# EAGLE design out_board (EAGLE 9.3.0)
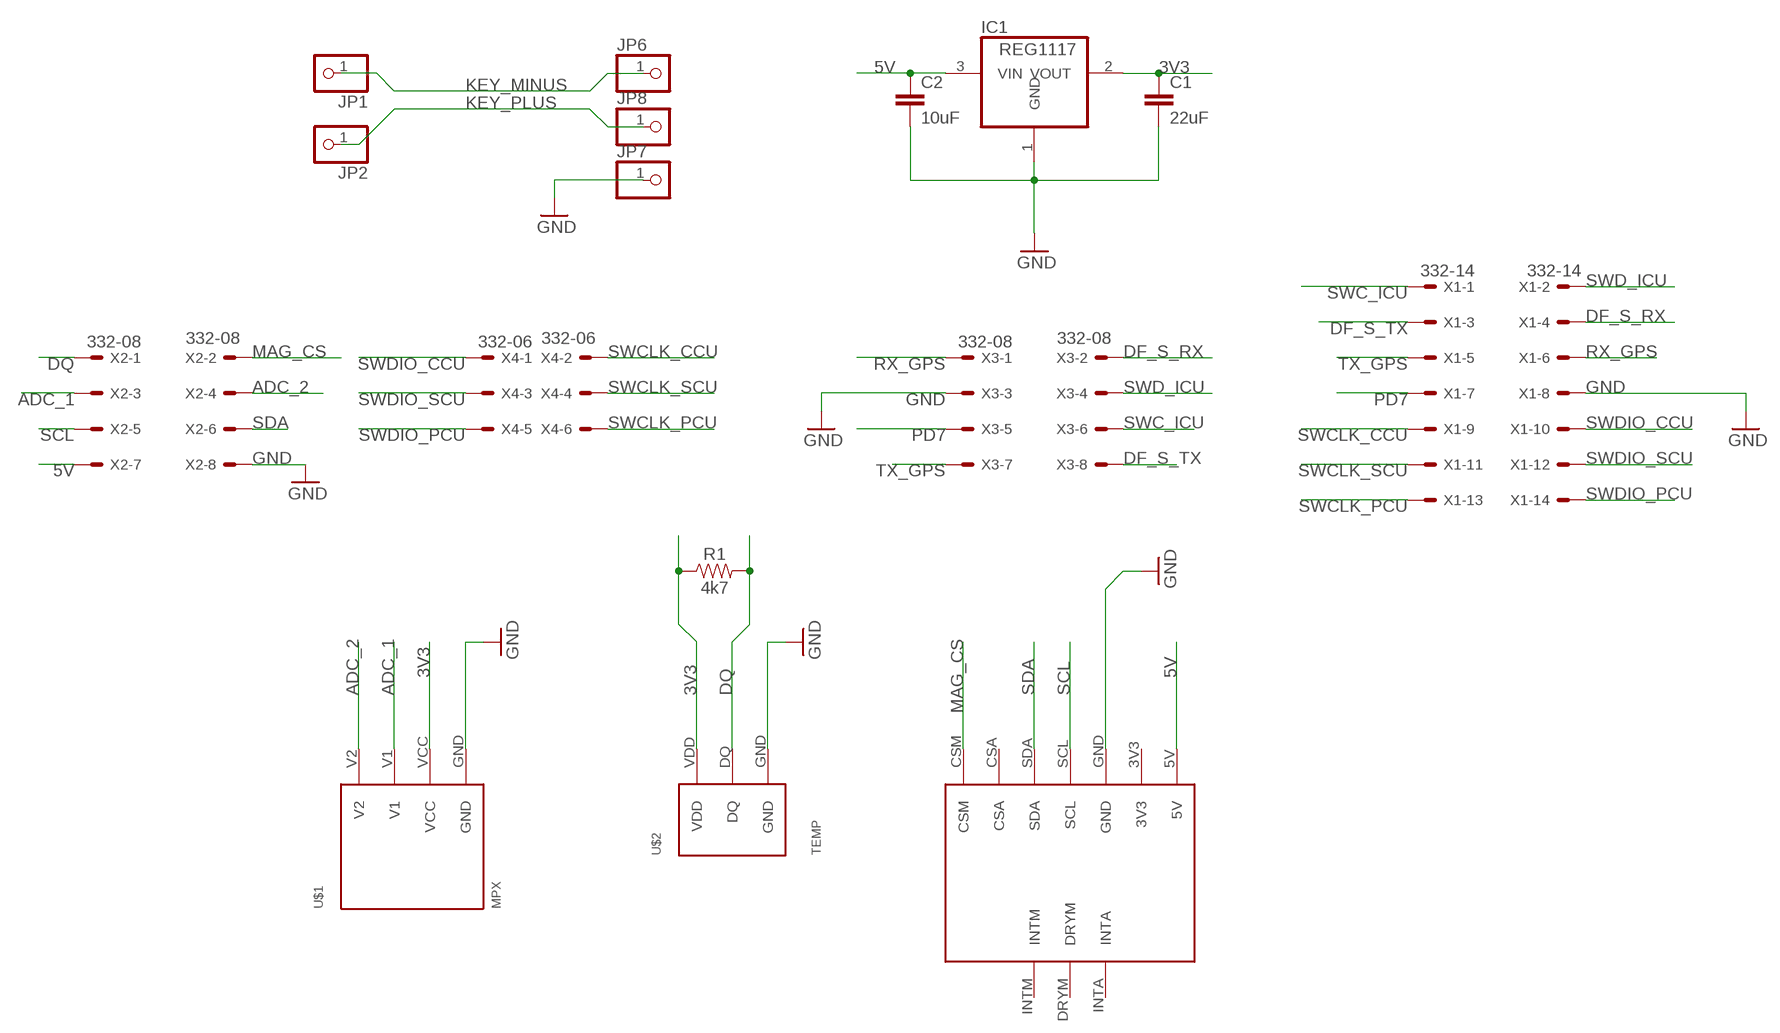
[diagram p0: schematic, sheet 1]

## Parts
C1  22uF  22UF-0805-6.3V-20%  [0805]
C2  10uF  22UF-0805-16V-20%  [0805]
IC1  REG1117  [SOT223]
JP1  PINHD-1X1  [1X01]
JP2  PINHD-1X1  [1X01]
JP6  PINHD-1X1  [1X01]
JP7  PINHD-1X1  [1X01]
JP8  PINHD-1X1  [1X01]
R1  4k7  RESISTORAXIAL-0.3  [AXIAL-0.3]
U$1  MPX  [MPX]
U$2  TEMP  [TEMP]
U$3  LSM303C  [LSM303C]
X1  332-14  [332-14]
X2  332-08  [332-08]
X3  332-08  [332-08]
X4  332-06  [332-06]

## Nets
3V3: C1.1 IC1.2(VOUT) R1.P$1 U$1.VCC U$2.VDD
5V: C2.1 IC1.3(VIN) U$3.5V X2.7
ADC_1: U$1.V1 X2.3
ADC_2: U$1.V2 X2.4
DF_S_RX: X1.4 X3.2
DF_S_TX: X1.3 X3.8
DQ: R1.P$2 U$2.DQ X2.1
GND: C1.2 C2.2 IC1.1(GND) JP7.1 U$1.GND U$2.GND U$3.GND X1.8 X2.8 X3.3
KEY_MINUS: JP1.1 JP6.1
KEY_PLUS: JP2.1 JP8.1
MAG_CS: U$3.CSM X2.2
PD7: X1.7 X3.5
RX_GPS: X1.6 X3.1
SCL: U$3.SCL X2.5
SDA: U$3.SDA X2.6
SWC_ICU: X1.1 X3.6
SWCLK_CCU: X1.9 X4.2
SWCLK_PCU: X1.13 X4.6
SWCLK_SCU: X1.11 X4.4
SWD_ICU: X1.2 X3.4
SWDIO_CCU: X1.10 X4.1
SWDIO_PCU: X1.14 X4.5
SWDIO_SCU: X1.12 X4.3
TX_GPS: X1.5 X3.7
Unconnected: U$3.3V3 U$3.CSA U$3.DRYM U$3.INTA U$3.INTM

## Library data of the parts
C1 = SparkFun-Capacitors:22UF: 22µF ceramic capacitors A capacitor is a passive two-terminal electrical component used to store electrical energy temporarily in an electric field.; PROD_ID: CAP-08402
C2 = SparkFun-Capacitors:22UF: 22µF ceramic capacitors A capacitor is a passive two-terminal electrical component used to store electrical energy temporarily in an electric field.; PROD_ID: CAP-14260; VALUE: 22uF
IC1 = burr-brown:REG1117: 800mA and 1A Low Dropout (LDO) Positive Regulator 1.8V, 2.5V, 2.85V, 3.3V, 5V, and Adj; MPN: REG1117; OC_FARNELL: 1097566; OC_NEWARK: 14P6981
JP1 JP2 JP6-JP8 = pinhead:PINHD-1X1: PIN HEADER
R1 = SparkFun-Resistors:RESISTOR: Generic Resistor Package
U$1 = bluepill:MPX
U$2 = bluepill:TEMP
U$3 = bluepill:LSM303C
X1 = con-garry:332-14: 14 Pin - 2mm Dual Row Source: www.mpe-connector.de / garry_shortform_2012.pdf
X2 X3 = con-garry:332-08: 8 Pin - 2mm Dual Row Source: www.mpe-connector.de / garry_shortform_2012.pdf
X4 = con-garry:332-06: 6 Pin - 2mm Dual Row Source: www.mpe-connector.de / garry_shortform_2012.pdf

## Board
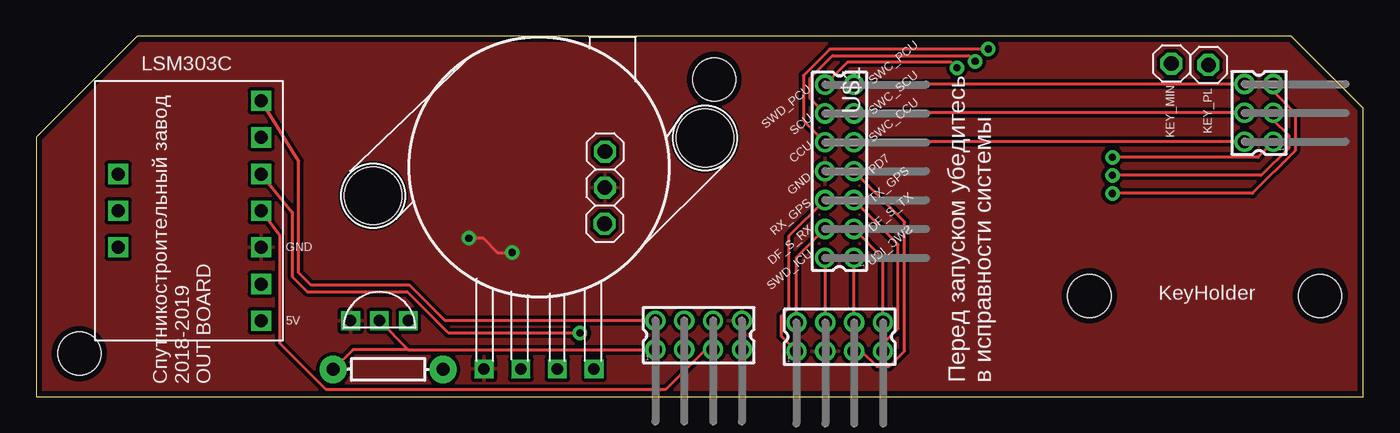
[diagram p1: board, top side]
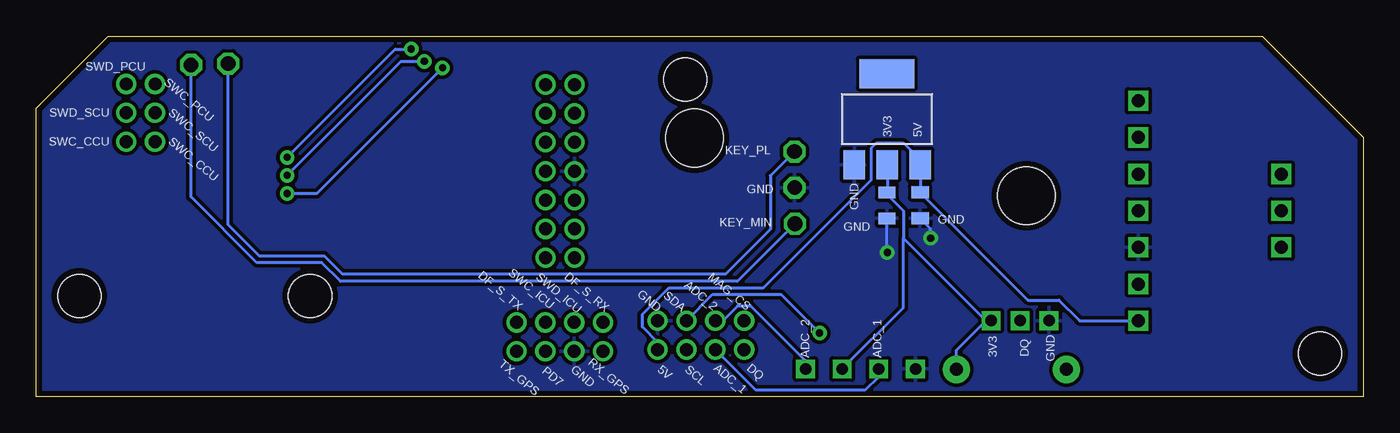
[diagram p2: board, bottom side, seen from below]

Size 92 x 25 mm. Coordinates in mm from the lower left corner, seen from the top.
Outline: 0,0 92,0 92,20 87,25 7,25 0,18 0,0
Copper layers (1*16): Top 0.035mm / dielectric 1mm / Bottom 0.035mm
Design rules "rezonit": minimum track width 0.2mm, minimum drill 0.5mm, track to track 0.25mm, track to pad 0.25mm, pad to pad 0.25mm, via to via 0.25mm, smd to smd 0.2mm, copper to edge 0.4mm, drill to drill 0.4mm, minimum pad ring 0.25mm, minimum via ring 0.25mm, stop-mask expansion 4mil, vias tented up to drill 0.6mm, thermal gap 10mil
Holes 3 mm at 3,3 47,22 89,7 73,7

### Footprints (pad centres in the part's own frame; a part is rotated, then mirrored left to right if it is on the bottom)
0805 = smd 0.8 x 1.2: 1 -0.9,0; 2 0.9,0
SOT223 = smd 1.499 x 2.007: 1 -2.261,-3.15; 2 0.025,-3.15; 3 2.311,-3.15 | smd 3.81 x 2.007: 4 0,3.15
1X01 = drill 1.016 octagon: 1 0,0
AXIAL-0.3 = drill 0.9 pad 1.88: P$1 -3.81,0; P$2 3.81,0
MPX = drill 0.8 square: GND 14,-3.81; V1 14,-1.27; V2 14,3.81; VCC 14,1.27 | hole 4: -2,11.5; 2,-11.5
TEMP = drill 0.8 square: DQ -0.5,0; GND -0.5,-2; VDD -0.5,2
LSM303C = drill 0.9 square: 3V3 -5,5.08; 5V -5,7.62; CSA -5,-5.08; CSM -5,-7.62; DRYM 4.9,0; GND -5,2.54; INTA 4.9,2.54; INTM 4.9,-2.54; SCL -5,0; SDA -5,-2.54
332-14 = drill 0.9 pad 1.27: 1 -6,-1; 2 -6,1; 3 -4,-1; 4 -4,1; 5 -2,-1; 6 -2,1; 7 0,-1; 8 0,1; 9 2,-1; 10 2,1; 11 4,-1; 12 4,1; 13 6,-1; 14 6,1
332-08 = drill 0.9 pad 1.27: 1 -3,-1; 2 -3,1; 3 -1,-1; 4 -1,1; 5 1,-1; 6 1,1; 7 3,-1; 8 3,1
332-06 = drill 0.9 pad 1.27: 1 -2,-1; 2 -2,1; 3 0,-1; 4 0,1; 5 2,-1; 6 2,1

### Placement (x,y rotation side)
C1  33.03,13.27 270 bottom
C2  30.73,13.28 270 bottom
IC1  33.03,19.25 0 bottom
JP1  81.26,23 0 top
JP2  78.68,23.1 0 top
JP6  39.4,12 0 top
JP7  39.42,14.5 0 top
JP8  39.44,17 0 top
R1  24.4,1.9 180 top
U$1  34.86,15.94 270 top
U$2  23.8,4.78 270 top
U$3  10.6,12.9 180 top
X1  55.68,15.64 90 top
X2  45.92,4.28 0 top
X3  55.7,4.16 0 top
X4  84.76,19.68 90 top

### Tracks (layer width: path | path; a pad name or v marks a point on that pad's centre or on a via)
3V3
  Bottom 0.2: IC1.2 33.01,14.2 C1.1 33.03,14.03 31.9,12.9 31.9,11 | 31.9,11 26.18,5.28 | 26.18,5.28 U$2.VDD | U$1.VCC 31.9,6.17 31.9,11 | R1.P$1 28.21,3.25 26.18,5.28
5V
  Bottom 0.2: X2.7 48.92,3.79 49.97,4.84 49.97,5.71 48.13,7.55 41.59,7.55 34.1,15.04 34.1,17.25 33.75,17.6 31.9,17.6 30.72,16.42 IC1.3 30.72,14.19 C2.1 23.25,6.7 21.1,6.7 19.7,5.3 19.7,5.28 U$3.5V
ADC_1
  Bottom 0.2: U$1.V1 33.59,1.41 34.5,0.5 42.14,0.5 X2.3
ADC_2
  Bottom 0.2: X2.4 44.41,5.28 43.35,6.33 42.48,6.33 38.67,2.52 U$1.V2
DF_S_RX
  Top 0.2: X3.2 52.7,9.66 X1.4
DF_S_TX
  Top 0.2: X3.8 58.7,9.62 X1.3
DQ
  Top 0.2: U$2.DQ 25.8,3.28 | 25.8,3.28 X2.1 | 25.8,3.28 21.97,3.28 R1.P$2
GND  (via drill 0.5)
  Top 0.2: v30,11 31,11 32,10 v33,10
  Bottom 0.2: v30,11 30,11.65 C2.2 | v33,10 33.03,10.03 C1.2
  pour Top: 0,0 0,18 7,25 87,25 92,20 92,0
  pour Bottom: 0,0 0,18 7,25 87,25 92,20 92,0
KEY_MINUS
  Bottom 0.2: JP6.1 43.4,8 70.9,8 72.2,9.3 76.7,9.3 81.26,13.86 JP1.1
KEY_PLUS
  Bottom 0.2: JP8.1 41.1,15.34 41.1,11.6 44.2,8.5 70.76,8.5 72.01,9.75 76.51,9.75 78.68,11.92 JP2.1
MAG_CS
  Top 0.2: X2.2 28.36,5.28 25.89,7.75 19.06,7.75 18.21,8.6 18.21,16.34 U$3.CSM
PD7
  Top 0.2: X3.5 57.22,3.16 58.27,2.11 59.13,2.11 60.2,3.17 60.2,12.12 X1.7
RX_GPS
  Top 0.2: X3.1 51.65,4.21 51.65,5.59 52.2,6.14 52.2,11.16 X1.6
SCL
  Top 0.2: X2.5 46.41,3.28 43.62,0.5 20.1,0.5 16.9,3.7 16.9,11.12 U$3.SCL
SDA  (via drill 0.5)
  Top 0.2: v37.7,4.43 28.57,4.43 25.7,7.3 18.8,7.3 17.76,8.34 17.76,12.8 U$3.SDA
  Bottom 0.2: X2.6 45.1,7.1 40.37,7.1 v37.7,4.43
SWC_ICU
  Top 0.2: X3.6 56.7,9.62 X1.1
SWCLK_CCU
  Top 0.2: X4.2 56.72,17.68 X1.9
SWCLK_PCU
  Top 0.2: X4.6 56.72,21.68 X1.13
SWCLK_SCU
  Top 0.2: X4.4 56.72,19.68 X1.11
SWD_ICU
  Top 0.2: X3.4 54.7,9.62 X1.2
SWDIO_CCU  (via drill 0.5)
  Top 0.2: X1.10 53.18,19.14 53.18,22.26 55.02,24.1 v66,24.1 | X4.1 84.68,16.6 v74.6,16.6
  Bottom 0.2: v74.6,16.6 67.1,24.1 v66,24.1
SWDIO_PCU  (via drill 0.5)
  Top 0.2: X1.14 55.72,22.68 55.77,22.73 56.24,23.2 63.43,23.2 v63.83,22.8 | X4.5 85.76,21.16 87.26,19.66 87.26,17.06 84.3,14.1 v74.6,14.1
  Bottom 0.2: v74.6,14.1 72.53,14.1 v63.83,22.8
SWDIO_SCU  (via drill 0.5)
  Top 0.2: X1.12 53.63,20.69 53.63,22.07 55.2,23.65 64.68,23.65 v65.08,23.25 | X4.3 85.76,19.16 86.81,18.11 86.81,17.25 84.92,15.35 v74.6,15.35
  Bottom 0.2: v74.6,15.35 66.7,23.25 v65.08,23.25
TX_GPS
  Top 0.2: X3.7 58.7,3.67 59.75,4.72 59.75,10.57 X1.5

### Text on the board
tPlace: LSM303C | SWD_PCU | SWC_PCU | KEY_MIN | KEY_PL | SCU | SWC_SCU | CCU | SWC_CCU | GND | PD7 | RX_GPS | TX_GPS | DF_S_RX | DF_S_TX | GND | SWD_ICU | SWC_ICU | KeyHolder | 5V | Спутникостроительный завод / 2018-2019 / OUT BOARD | Перед запуском убедитесь / в исправности системы
bPlace: SWD_PCU | SWC_PCU | SWC_SCU | SWD_SCU | 5V | 3V3 | SWC_CCU | SWC_CCU | KEY_PL | GND | GND | GND | GND | KEY_MIN | MAG_CS | ADC_2 | SDA | GND | DF_S_RX | SWD_ICU | SWC_ICU | DF_S_TX | GND | DQ | 3V3 | ADC_1 | ADC_2 | DQ | ADC_1 | SCL | 5V | RX_GPS | GND | PD7 | TX_GPS